# EAGLE schematic Child_Board_Sensor (EAGLE 9.6.1)
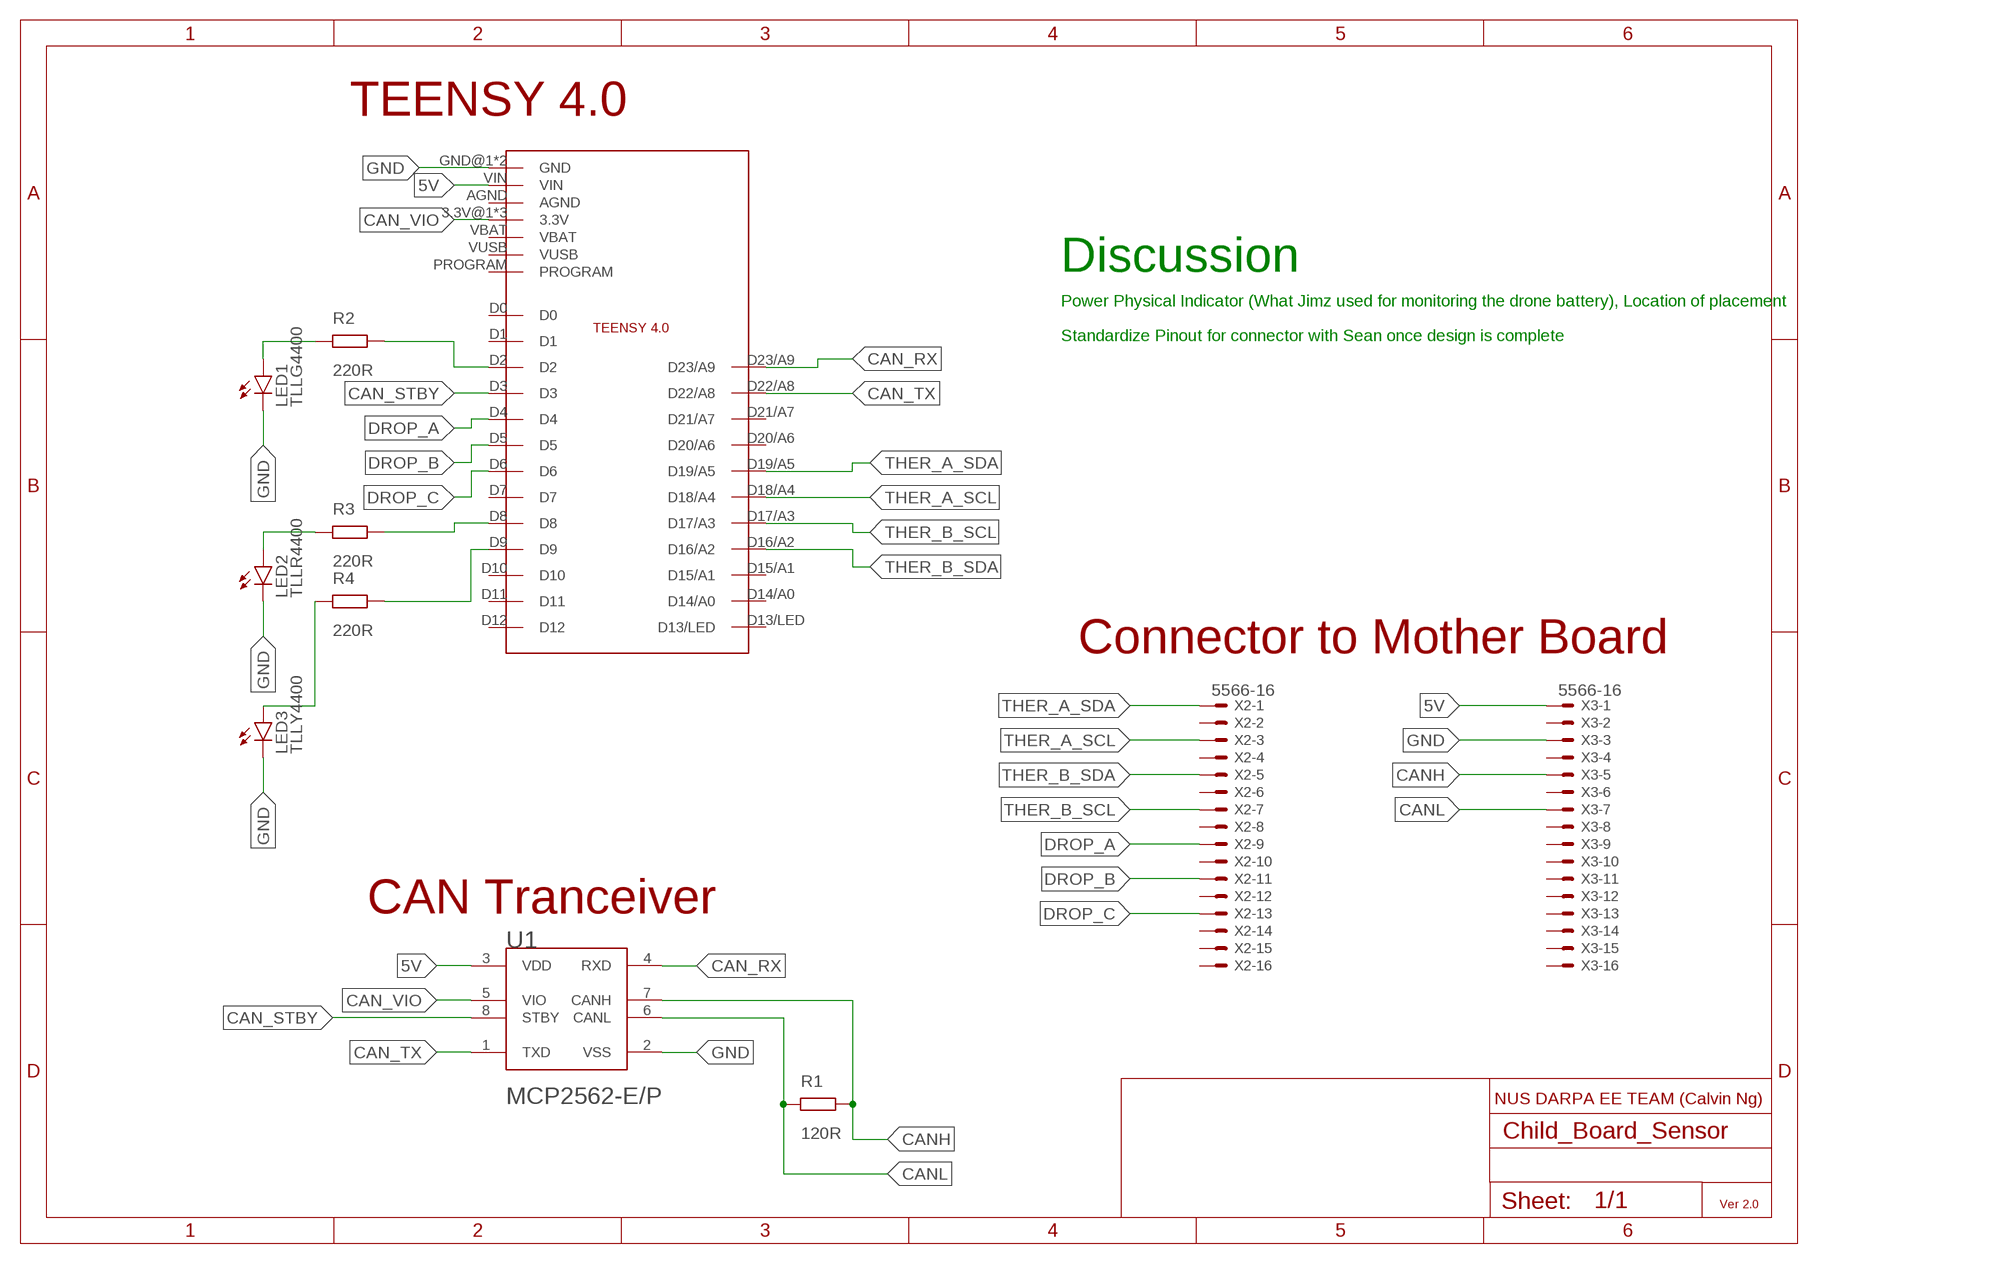
[diagram p0: schematic, sheet 1]

## Parts
LED1  TLLG4400  [LED3MM]
LED2  TLLR4400  [LED3MM]
LED3  TLLY4400  [LED3MM]
R1  R  (no package)
R2  R  (no package)
R3  R  (no package)
R4  R  (no package)
U1  MICROCHIP_MCP2562-E-PMICROCHIP_MCP2562-E-P_0_0  [MICROCHIP_MCP2562-E-P_0]
U$1  TEENSY4.0  [TEENSY4.0]
X2  5566-16  [5566-16]
X3  5566-16  [5566-16]

## Nets
5V: U1.3(VDD) U$1.VIN X3.1
CAN_RX: U1.4(RXD) U$1.D23/A9
CAN_STBY: U1.8(STBY) U$1.D3
CAN_TX: U1.1(TXD) U$1.D22/A8
CAN_VIO: U1.5(VIO) U$1.3.3V@1(3.3V) U$1.3.3V@2(3.3V) U$1.ON/OFF(3.3V)
CANH: R1.2 U1.7(CANH) X3.5
CANL: R1.1 U1.6(CANL) X3.7
DROP_A: U$1.D4 X2.9
DROP_B: U$1.D5 X2.11
DROP_C: U$1.D6 X2.13
GND: LED1.K(C) LED2.K(C) LED3.K(C) U1.2(VSS) U$1.GND@1(GND) U$1.GND@2(GND) X3.3
N$1: LED1.A R2.1
N$2: R2.2 U$1.D2
N$3: R3.2 U$1.D8
N$4: LED2.A R3.1
N$5: LED3.A R4.1
N$6: R4.2 U$1.D9
THER_A_SCL: U$1.D18/A4 X2.3
THER_A_SDA: U$1.D19/A5 X2.1
THER_B_SCL: U$1.D17/A3 X2.7
THER_B_SDA: U$1.D16/A2 X2.5
Unconnected: U$1.AGND U$1.D0 U$1.D1 U$1.D7 U$1.D10 U$1.D11 U$1.D12 U$1.D13/LED U$1.D14/A0 U$1.D15/A1 U$1.D20/A6 U$1.D21/A7 U$1.PROGRAM U$1.VBAT U$1.VUSB X2.2 X2.4 X2.6 X2.8 X2.10 X2.12 X2.14 X2.15 X2.16 X3.2 X3.4 X3.6 X3.8 X3.9 X3.10 X3.11 X3.12 X3.13 X3.14 X3.15 X3.16

## Notes on the sheet
- TEENSY 4.0
- Discussion
- Power Physical Indicator (What Jimz used for monitoring the drone battery), Location of placement
- Standardize Pinout for connector with Sean once design is complete
- Connector to Mother Board
- CAN Tranceiver
- NUS DARPA EE TEAM (Calvin Ng)
- Ver 2.0

## Library data of the parts
LED1 = led:TLLG4400: Low Current (2mA) LED 3 mm Tinted Diffused Package color GREEN Source: Data sheet <http://www.farnell.com/datasheets/391098.pdf>; MF: VISHAY SEMICONDUCTOR; OC_FARNELL: 1612435
LED2 = led:TLLR4400: Low Current (2mA) LED 3 mm Tinted Diffused Package color RED Source: Data sheet <http://www.farnell.com/datasheets/391100.pdf>; MF: VISHAY SEMICONDUCTOR; OC_FARNELL: 1612437
LED3 = led:TLLY4400: Low Current (2mA) LED 3 mm Tinted Diffused Package color YELLOW Source: Data sheet <http://www.farnell.com/datasheets/391098.pdf>; MF: VISHAY SEMICONDUCTOR; OC_FARNELL: 1612439
R1 = ngspice-simulation:R: RESISTOR; _EXTERNAL_: 120R
R2-R4 = ngspice-simulation:R: RESISTOR; _EXTERNAL_: 220R
U1 = P:MICROCHIP_MCP2562-E-P: High-Speed CAN Transceiver; CENTROID_NOT_SPECIFIED: No; DATASHEET: https://upverter.com/datasheet/b25546fff9d94e99fcb0dd0aedffb11e407de813.pdf; DIGIKEY_DESCRIPTION: IC TXRX CAN 8DIP; DIGIKEY_PART_NUMBER: MCP2562-E/P-ND; IMPORTED_FROM: octopart; IPC_LAND_PATTERN_NAME: DIP787W46P254L927H533Q8; LEAD_FREE: yes; MF: Microchip; MOUSER_PART_NUMBER: 579-MCP2562-E/P; MPN: MCP2562-E/P; NUM_PINS: 8; OCTOPART_PART_NUMBER: 926e5ad67c164da9; PACKAGE: PDIP8; PREFIX: U; ROHS: yes; TEMPERATURE_RANGE_HIGH: +125°C; TEMPERATURE_RANGE_LOW: -40°C
U$1 = Teensy4.0:TEENSY4.0
X2 X3 = con-molex:5566-16: Mini FIT connector 16 pol Source: http://www.molex.com; MF: MOLEX; OC_FARNELL: unknown; OC_NEWARK: unknown